# EasyEDA Pro project Instruction_Register.eprj

# Schematic Schematic2
Board Name: Board2; Create Date: 2025-08-15; Page Name: P1; Project Name: Instruction_Register; Schematic Name: Schematic2; Update Date: 2025-08-15; Company: EasyEDA.com; Page Size: A4; Version: V1.0
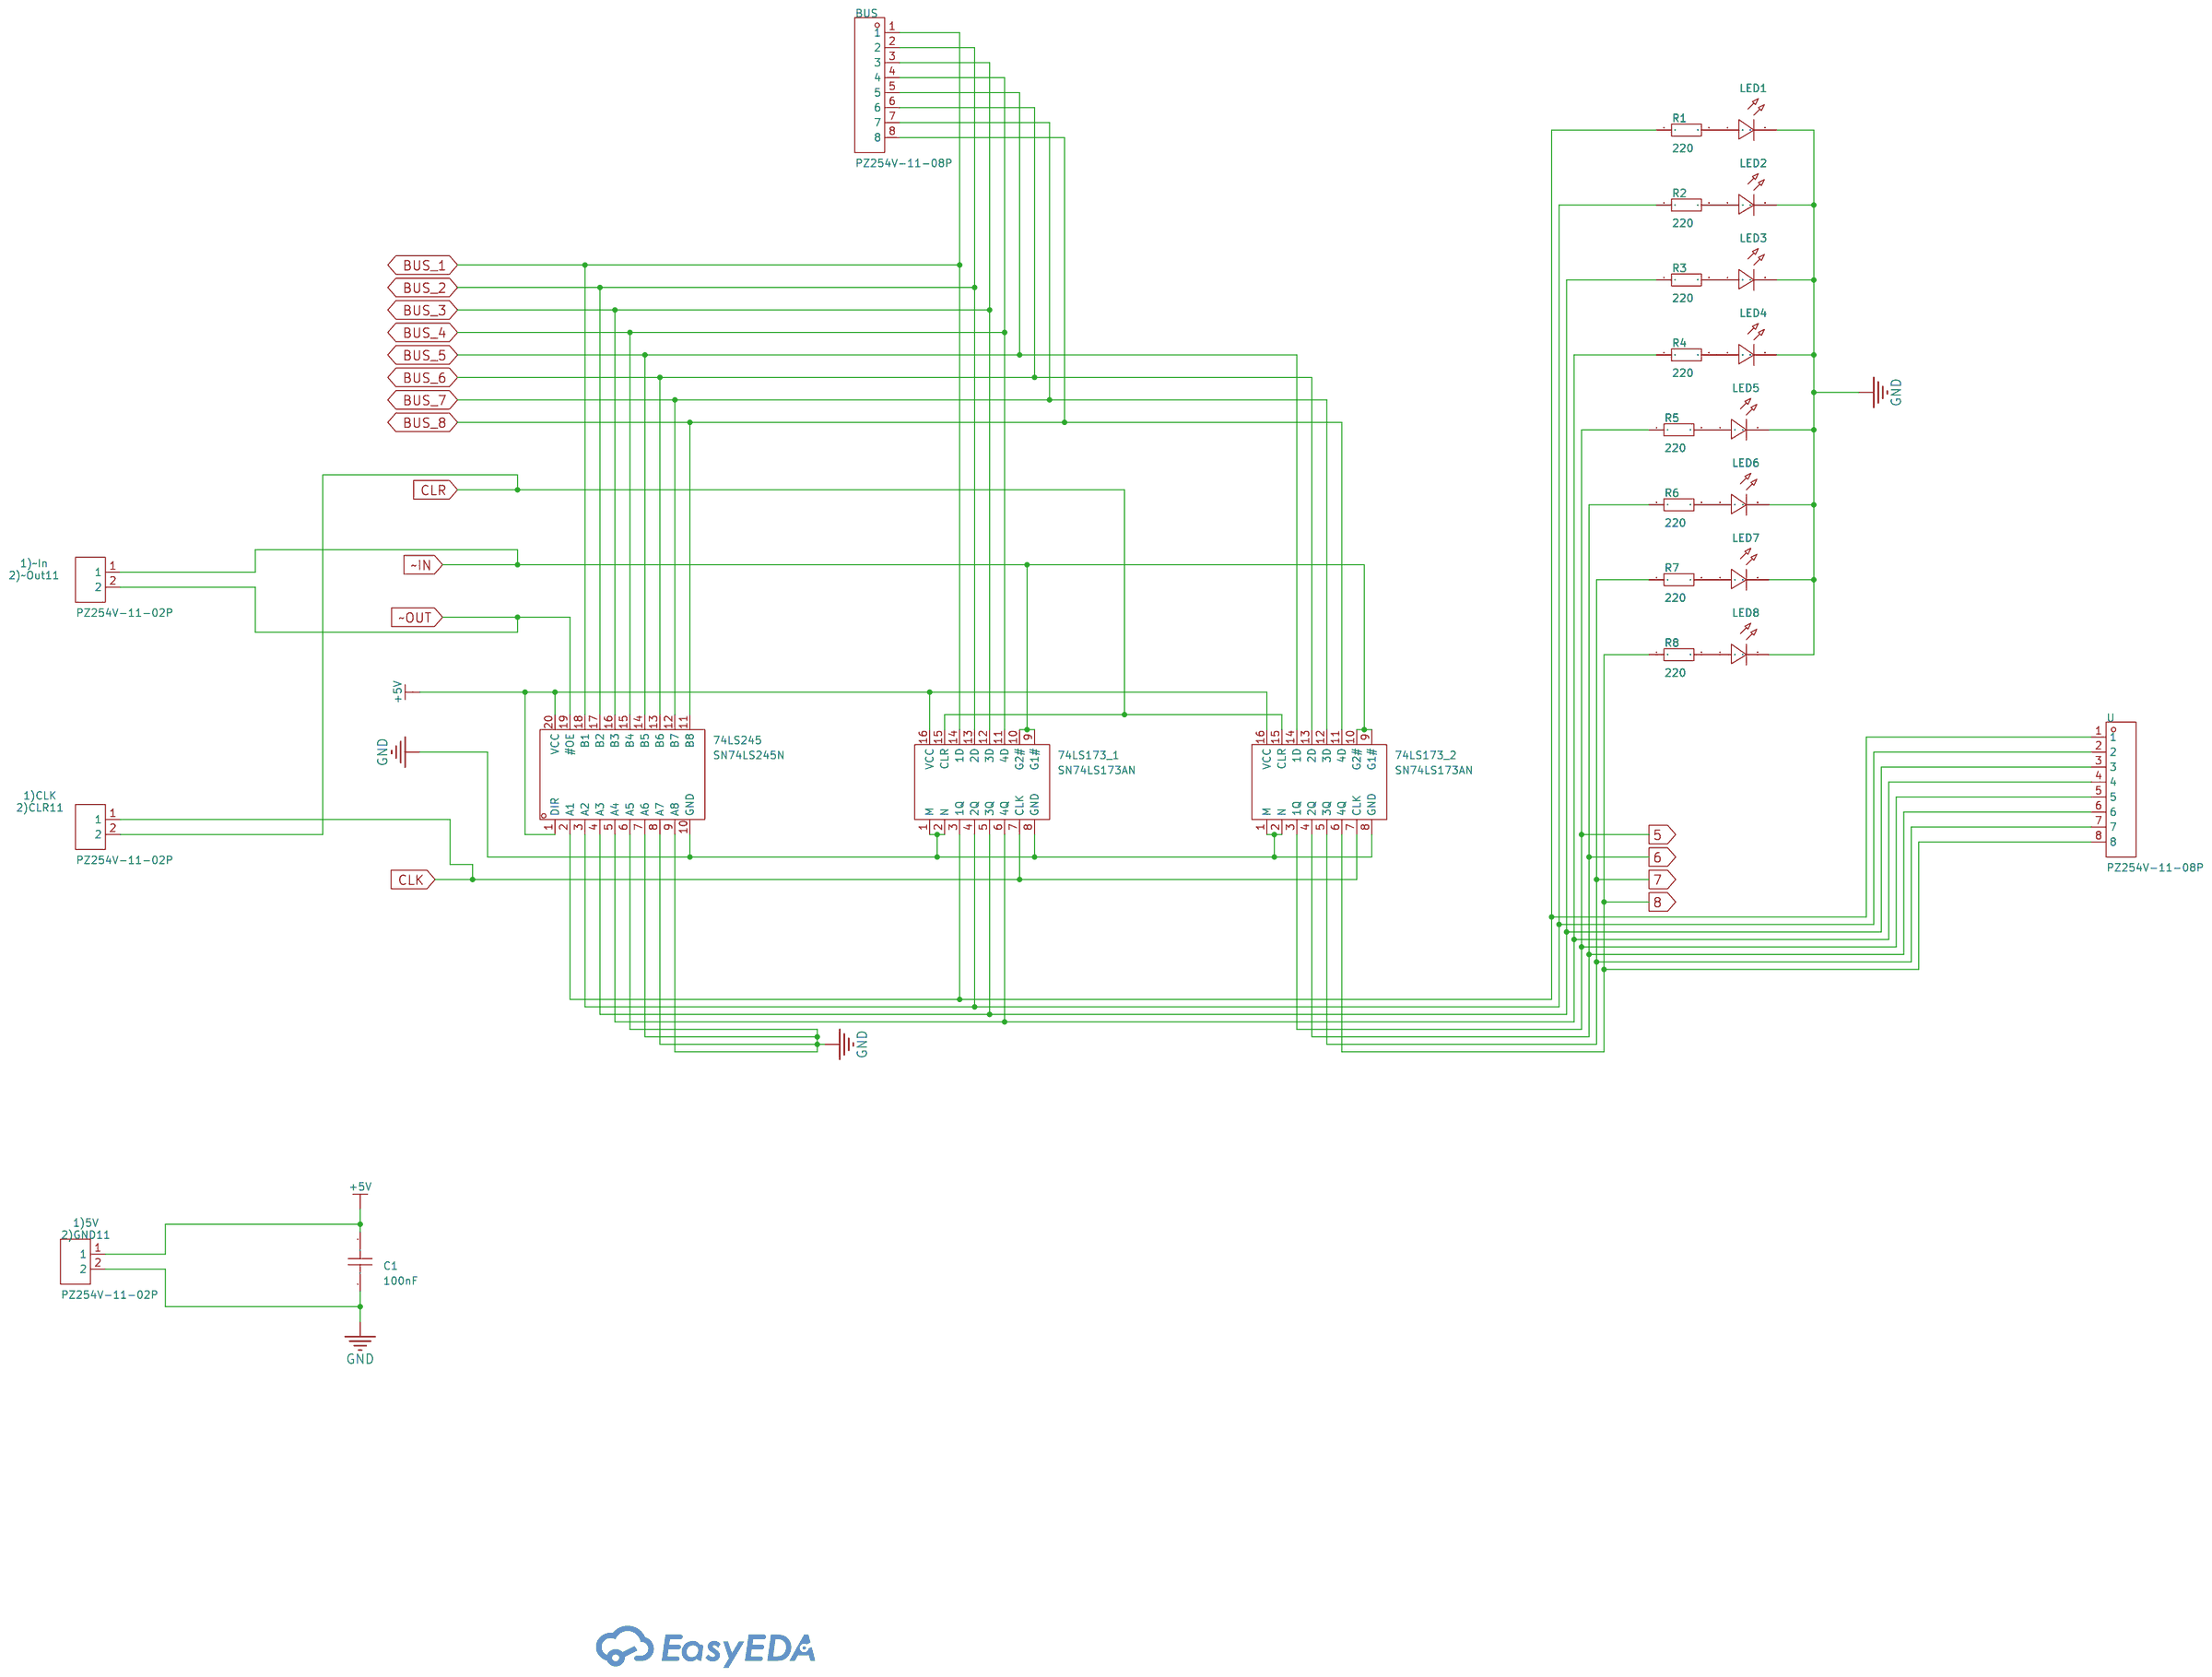
[diagram p0: schematic sheet]

## Parts
1)5V
2)GND11  PZ254V-11-02P  [HDR-TH_2P-P2.54-V-M]
1)CLK
2)CLR11  PZ254V-11-02P  [HDR-TH_2P-P2.54-V-M]
1)~In
2)~Out11  PZ254V-11-02P  [HDR-TH_2P-P2.54-V-M]
74LS173_1  SN74LS173AN  [PDIP-16_L19.3-W6.4-P2.54-LS7.94-BL]
74LS173_2  SN74LS173AN  [PDIP-16_L19.3-W6.4-P2.54-LS7.94-BL]
74LS245  SN74LS245N  [DIP-20_L25.5-W10.0-P2.54-LS7.6-BL]
BUS  PZ254V-11-08P  [HDR-TH_8P-P2.54-V-M]
C1  100nF  [CAP-TH_L8.5-W5.0-P5.00-D1.2]
LED1  -  [LED-TH_BD5.8-P2.54-FD]
LED2  -  [LED-TH_BD5.8-P2.54-FD]
LED3  -  [LED-TH_BD5.8-P2.54-FD]
LED4  -  [LED-TH_BD5.8-P2.54-FD]
LED5  -  [LED-TH_BD5.8-P2.54-FD]
LED6  -  [LED-TH_BD5.8-P2.54-FD]
LED7  -  [LED-TH_BD5.8-P2.54-FD]
LED8  -  [LED-TH_BD5.8-P2.54-FD]
R1  220  [R_AXIAL-0.4]
R2  220  [R_AXIAL-0.4]
R3  220  [R_AXIAL-0.4]
R4  220  [R_AXIAL-0.4]
R5  220  [R_AXIAL-0.4]
R6  220  [R_AXIAL-0.4]
R7  220  [R_AXIAL-0.4]
R8  220  [R_AXIAL-0.4]
U  PZ254V-11-08P  [HDR-TH_8P-P2.54-V-M]

## Library data of the parts
1)5V
2)GND11 1)CLK
2)CLR11 1)~In
2)~Out11 = PZ254V-11-02P: Pin Structure:1x2P Pitch:2.54mm Row Spacing:- Circluar Pins/Square Pins:Policy Mounting Type:Straight Number of Rows:Single Row Number of Pins:2P Current Rating:- Voltage Rating (Max):- Length of Mating Pin:6mm Insulation Height:2.5mm Length of End Connec; LCSC Part Name: 1x2P 间距:2.54mm 方针 直插; Supplier Part: C492401; Manufacturer: XFCN(兴飞); Supplier Footprint: 插件,P=2.54mm; JLCPCB Part Class: Extended Part; Datasheet: https://atta.szlcsc.com/upload/public/pdf/source/20200309/C492401_A812433581A9B211A7FFA413ADDFF0E5.pdf; Supplier: LCSC; Pin Structure: 1x2P; Pitch: 2.54mm; Circluar Pins/Square Pins: Policy; Mounting Type: Straight; Number of Rows: Single Row; Number of Pins: 2P; Length of Mating Pin: 6mm; Insulation Height: 2.5mm; Length of End Connection Pin: 3mm; Contact Material: Brass; Operating Temperature: -40℃~+105℃; Color: Black
74LS173_1 74LS173_2 = SN74LS173AN: Type:D-Type Trigger Type:Rising Edge Voltage - Supply:4.75V~5.25V Voltage - Supply:4.75V~5.25V Clock Frequency:50MHz Function:Reset Number of Elements:1 Number of Bits per Element:4 Output Type:- Propagation Delay:30ns@5V,45pF Series:74LS Series Current -; Supplier Part: C1550125; Manufacturer: TI(德州仪器); Supplier Footprint: PDIP-16; JLCPCB Part Class: Extended Part; Datasheet: https://www.ti.com/cn/lit/gpn/sn74ls173a; Supplier: LCSC; Type: D-Type; Trigger Type: Rising Edge; Voltage - Supply: 4.75V~5.25V; Clock Frequency: 50MHz; Function: Reset; Number of Elements: 1; Number of Bits per Element: 4; Propagation Delay: 30ns@5V,45pF; Series: 74LS Series; Current - Output Low(IOL): 24mA; Current - Output High(IOH): 2.6mA; Quiescent Current: 24mA; Operating Temperature: 0℃~+70℃
74LS245 = SN74LS245N: output type:Tri-State Voltage - Supply:4.75V~5.25V Voltage - Supply:4.75V~5.25V Number of Elements:1 Number of Bits per Element:8 Current - Output Low(IOL):24mA Current - Output High(IOH):15mA Logic Family:74LS Operating Temperature:0℃~+70℃ Operating Temp; Supplier Part: C352966; Manufacturer: TI(德州仪器); Supplier Footprint: DIP-20; JLCPCB Part Class: Extended Part; Datasheet: https://www.ti.com/cn/lit/gpn/sn74ls245; Supplier: LCSC; output type: Tri-State; Voltage - Supply: 4.75V~5.25V; Number of Elements: 1; Number of Bits per Element: 8; Current - Output Low(IOL): 24mA; Current - Output High(IOH): 15mA; Logic Family: 74LS; Operating Temperature: 0℃~+70℃
BUS U = PZ254V-11-08P: Pin Structure:1x8P Pitch:2.54mm Row Spacing:- Circluar Pins/Square Pins:Square Pins Mounting Type:Straight Number of Rows:Plugin Number of Pins:8P Current Rating (Max):- Voltage Rating (Max):- Length of Mating Pin:6mm Insulation Height:2.5mm Length of End; LCSC Part Name: 间距:2.54mm 1x8P 直插 方针; Supplier Part: C492407; Manufacturer: XFCN(兴飞); Supplier Footprint: 插件,P=2.54mm; JLCPCB Part Class: Extended Part; Datasheet: https://atta.szlcsc.com/upload/public/pdf/source/20200309/C492407_83A6FB26A2233368EDB9516968EC6149.pdf; Supplier: LCSC; Pin Structure: 1x8P; Pitch: 2.54mm; Circluar Pins/Square Pins: Square Pins; Mounting Type: Straight; Number of Rows: Plugin; Number of Pins: 8P; Length of Mating Pin: 6mm; Insulation Height: 2.5mm; Length of End Connection Pin: 3mm; Operating Temperature Range: -40℃~+105℃; Color: Black
C1 = CT4-0805B104K500F3: Capacitance:100nF Tolerance:±10% Tolerance:±10% Voltage Rated: Temperature Coefficient:; LCSC Part Name: 100nF ±10% 50V C3型（直脚）; Supplier Part: C84772; Manufacturer: FH(风华); Supplier Footprint: 插件,P=5.08mm; JLCPCB Part Class: Extended Part; Datasheet: https://atta.szlcsc.com/upload/public/pdf/source/20190402/C385200_059806A6312B28FF1421A2413EB641E1.pdf; Supplier: LCSC; Tolerance: ±10%
LED1-LED8 = LED_TH-R_5mm: Supplier Footprint: Through
R1-R8 = Res_AXIAL-1/4W: Supplier Footprint: Through

## Nets
+5V: 1)5V
2)GND11.1 74LS173_1.16(VCC) 74LS173_2.16(VCC) 74LS245.1(DIR) 74LS245.20(VCC) C1.1
GND: 1)5V
2)GND11.2 74LS173_1.1(M) 74LS173_1.2(N) 74LS173_1.8(GND) 74LS173_2.1(M) 74LS173_2.2(N) 74LS173_2.8(GND) 74LS245.6(A5) 74LS245.7(A6) 74LS245.8(A7) 74LS245.9(A8) 74LS245.10(GND) C1.2 LED1.2(A) LED2.2(A) LED3.2(A) LED4.2(A) LED5.2(A) LED6.2(A) LED7.2(A) LED8.2(A)
5: 74LS173_2.3(1Q) R5.1 U.5
6: 74LS173_2.4(2Q) R6.1 U.6
7: 74LS173_2.5(3Q) R7.1 U.7
8: 74LS173_2.6(4Q) R8.1 U.8
BUS_1: 74LS173_1.14(1D) 74LS245.18(B1) BUS.1
BUS_2: 74LS173_1.13(2D) 74LS245.17(B2) BUS.2
BUS_3: 74LS173_1.12(3D) 74LS245.16(B3) BUS.3
BUS_4: 74LS173_1.11(4D) 74LS245.15(B4) BUS.4
BUS_5: 74LS173_2.14(1D) 74LS245.14(B5) BUS.5
BUS_6: 74LS173_2.13(2D) 74LS245.13(B6) BUS.6
BUS_7: 74LS173_2.12(3D) 74LS245.12(B7) BUS.7
BUS_8: 74LS173_2.11(4D) 74LS245.11(B8) BUS.8
CLK: 1)CLK
2)CLR11.1 74LS173_1.7(CLK) 74LS173_2.7(CLK)
CLR: 1)CLK
2)CLR11.2 74LS173_1.15(CLR) 74LS173_2.15(CLR)
~IN: 1)~In
2)~Out11.1 74LS173_1.9(G1#) 74LS173_1.10(G2#) 74LS173_2.9(G1#) 74LS173_2.10(G2#)
~OUT: 1)~In
2)~Out11.2 74LS245.19(#OE)
$1N2512: LED1.1(C) R1.2
$1N2517: 74LS173_1.6(4Q) 74LS245.5(A4) R4.1 U.4
$1N2518: 74LS173_1.5(3Q) 74LS245.4(A3) R3.1 U.3
$1N2519: 74LS173_1.4(2Q) 74LS245.3(A2) R2.1 U.2
$1N2520: 74LS173_1.3(1Q) 74LS245.2(A1) R1.1 U.1
$1N2521: LED8.1(C) R8.2
$1N2522: LED7.1(C) R7.2
$1N2523: LED6.1(C) R6.2
$1N2524: LED5.1(C) R5.2
$1N2525: LED4.1(C) R4.2
$1N2526: LED3.1(C) R3.2
$1N2527: LED2.1(C) R2.2

# Board PCB2
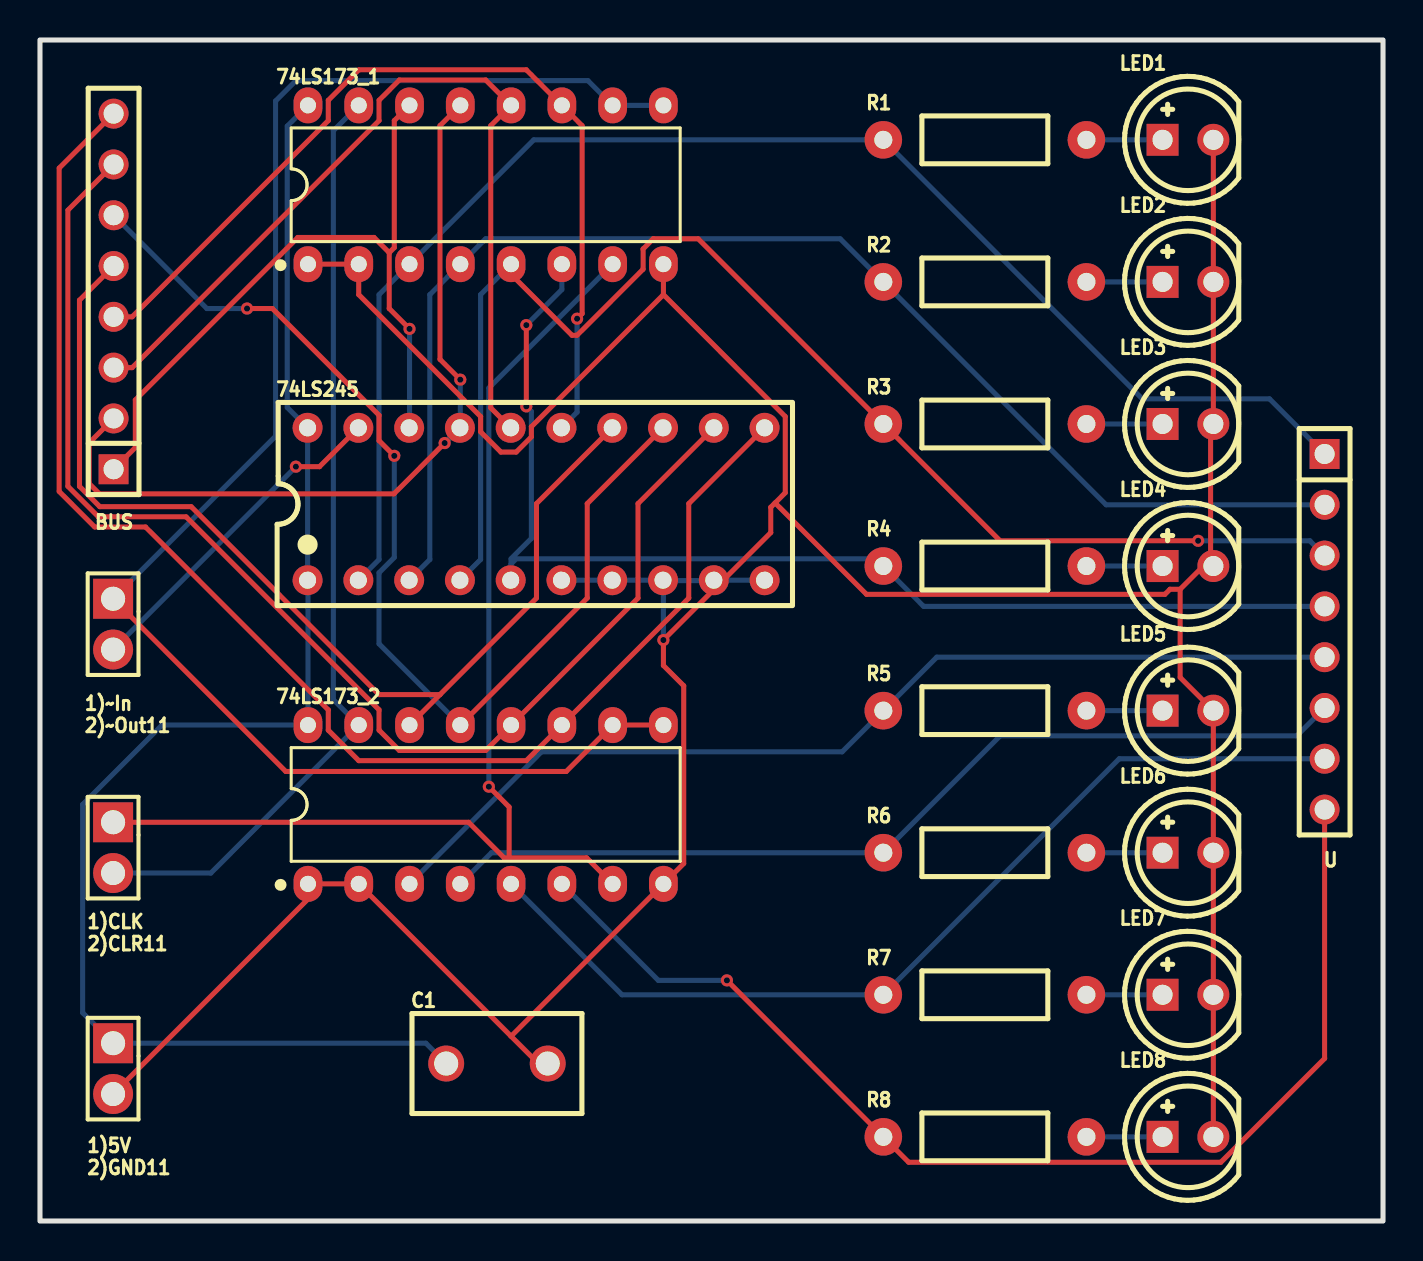
[diagram p1: board, top side]
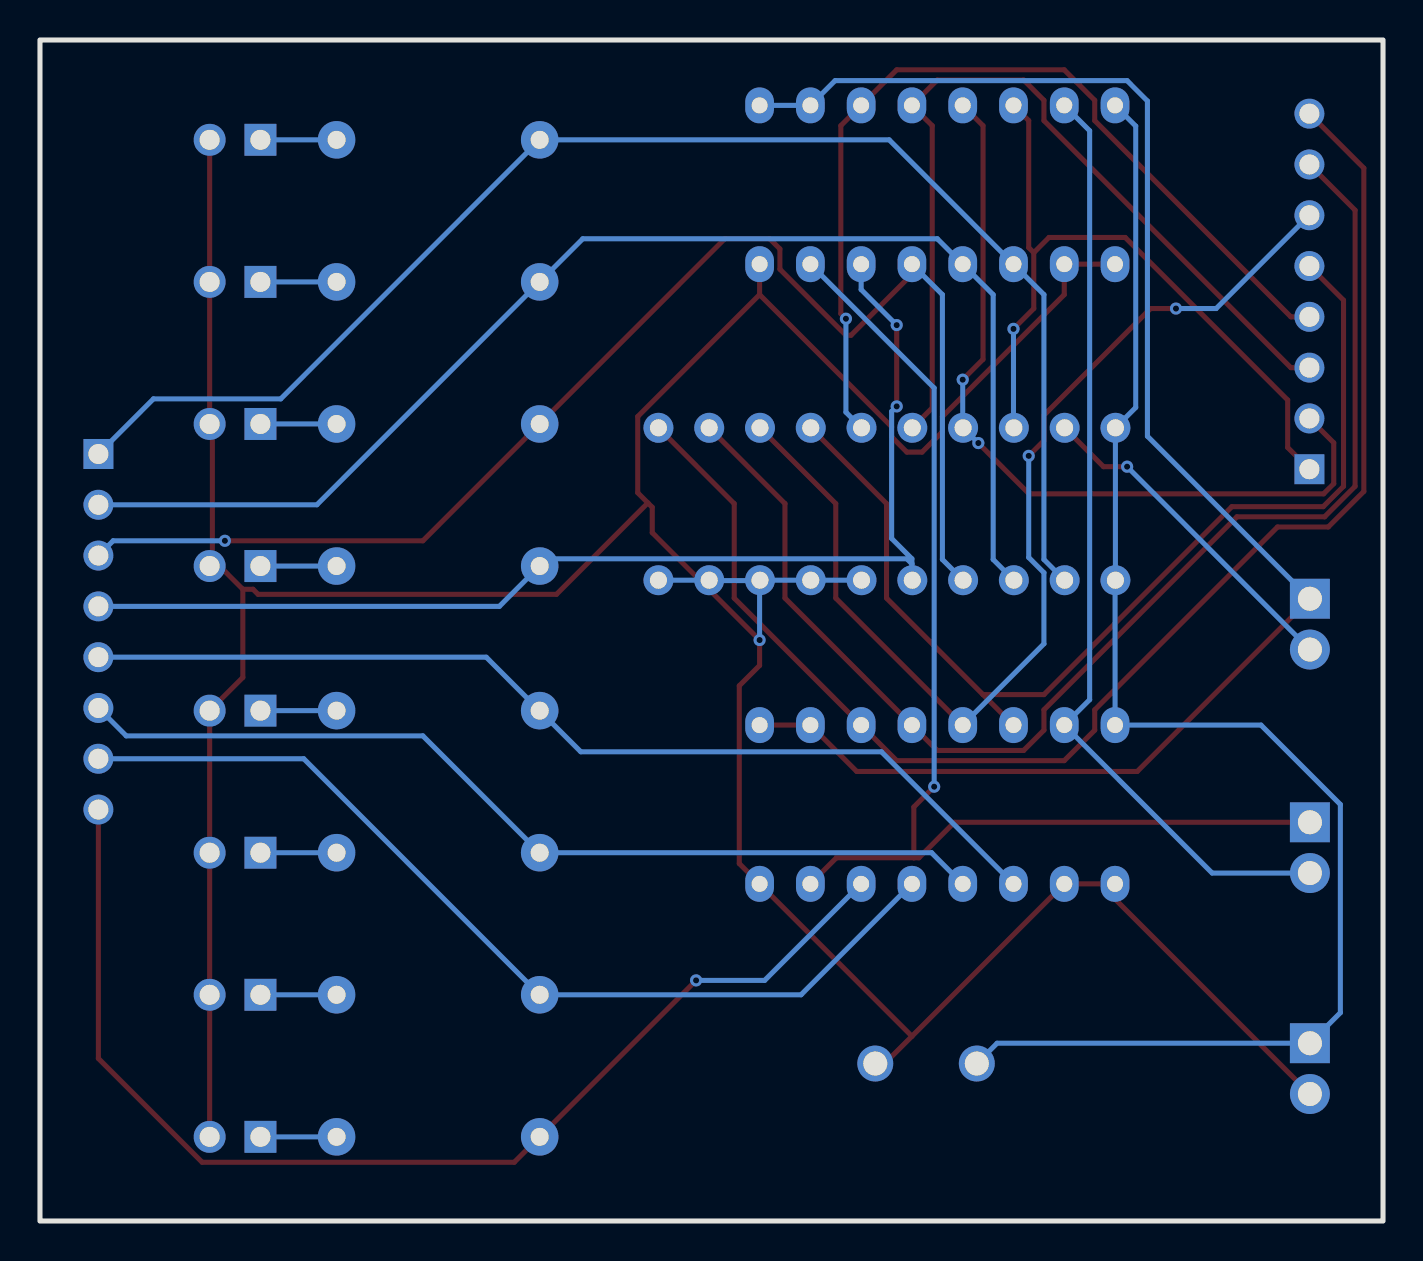
[diagram p2: board, bottom side, seen from below]

Outline 67.18 x 59.05 mm; copper layers: Top Layer, Bottom Layer. Coordinates in mm from the lower left corner of the outline.
Outline path: rectangle 0,59.05 67.18,0
Stack: Top Layer 0.035mm / Dielectric1 1.51mm FR4 er 4.5 / Bottom Layer 0.035mm

## Design rules (mm)
template: JLCPCB Capability(Two Layers Board)
spacing copperThickness1oz (default): track to track 0.102, other pairs 0.152 to 0.3
spacing copperThickness2oz: track to track 0.203, other pairs 0.152 to 0.3
track width copperThickness1oz (default): min 0.127, default 0.254, max 2.54
track width copperThickness2oz: min 0.203, default 0.254, max 2.54
differential pair differentialPair (default): width min 0.127, default 0.254, max 2.54; gap min 0.152, default 0.152
via viaSize (default): diameter min 0.5, default 0.61, max 10; hole min 0.3, default 0.305, max 6.3

## Placement (name value [footprint] x y rotation side)
1)5V
2)GND11  PZ254V-11-02P  [HDR-TH_2P-P2.54-V-M]  3.66 7.62 270 top
1)CLK
2)CLR11  PZ254V-11-02P  [HDR-TH_2P-P2.54-V-M]  3.66 18.67 270 top
1)~In
2)~Out11  PZ254V-11-02P  [HDR-TH_2P-P2.54-V-M]  3.66 29.84 270 top
74LS173_1  SN74LS173AN  [PDIP-16_L19.3-W6.4-P2.54-LS7.94-BL]  22.3 51.82 0 top
74LS173_2  SN74LS173AN  [PDIP-16_L19.3-W6.4-P2.54-LS7.94-BL]  22.3 20.83 0 top
74LS245  SN74LS245N  [DIP-20_L25.5-W10.0-P2.54-LS7.6-BL]  24.82 35.85 0 top
BUS  PZ254V-11-08P  [HDR-TH_8P-P2.54-V-M]  3.68 46.48 90 top
C1  100nF  [CAP-TH_L8.5-W5.0-P5.00-D1.2]  22.86 7.87 0 top
LED1  -  [LED-TH_BD5.8-P2.54-FD]  57.43 54.06 0 top
LED2  -  [LED-TH_BD5.8-P2.54-FD]  57.43 46.96 0 top
LED3  -  [LED-TH_BD5.8-P2.54-FD]  57.43 39.85 0 top
LED4  -  [LED-TH_BD5.8-P2.54-FD]  57.43 32.75 0 top
LED5  -  [LED-TH_BD5.8-P2.54-FD]  57.43 25.52 0 top
LED6  -  [LED-TH_BD5.8-P2.54-FD]  57.43 18.42 0 top
LED7  -  [LED-TH_BD5.8-P2.54-FD]  57.43 11.31 0 top
LED8  -  [LED-TH_BD5.8-P2.54-FD]  57.43 4.21 0 top
R1  220  [R_AXIAL-0.4]  47.27 54.06 0 top
R2  220  [R_AXIAL-0.4]  47.27 46.96 0 top
R3  220  [R_AXIAL-0.4]  47.27 39.85 0 top
R4  220  [R_AXIAL-0.4]  47.27 32.75 0 top
R5  220  [R_AXIAL-0.4]  47.27 25.52 0 top
R6  220  [R_AXIAL-0.4]  47.27 18.42 0 top
R7  220  [R_AXIAL-0.4]  47.27 11.31 0 top
R8  220  [R_AXIAL-0.4]  47.27 4.21 0 top
U  PZ254V-11-08P  [HDR-TH_8P-P2.54-V-M]  64.26 29.46 270 top

## Footprints (pads in the part's own frame, mm; a bottom-side part is the same pattern mirrored in y, then rotated)
CAP-TH_L8.5-W5.0-P5.00-D1.2
  round 1.8 hole 1.2: 1(-2.54,0) 2(2.54,0)
DIP-20_L25.5-W10.0-P2.54-LS7.6-BL
  round 1.5 hole 0.85: 1(-11.43,-3.81) 2(-8.89,-3.81) 3(-6.35,-3.81) 4(-3.81,-3.81) 5(-1.27,-3.81) 6(1.27,-3.81) 7(3.81,-3.81) 8(6.35,-3.81) 9(8.89,-3.81) 10(11.43,-3.81) 11(11.43,3.81) 12(8.89,3.81) 13(6.35,3.81) 14(3.81,3.81) 15(1.27,3.81) 16(-1.27,3.81) 17(-3.81,3.81) 18(-6.35,3.81) 19(-8.89,3.81) 20(-11.43,3.81)
HDR-TH_2P-P2.54-V-M
  rect 2x2 hole 1.2: 1(-1.27,0)
  round 2 hole 1.2: 2(1.27,0)
HDR-TH_8P-P2.54-V-M
  rect 1.5x1.5 hole 1: 1(-8.89,0)
  round 1.5 hole 1: 2(-6.35,0) 3(-3.81,0) 4(-1.27,0) 5(1.27,0) 6(3.81,0) 7(6.35,0) 8(8.89,0)
LED-TH_BD5.8-P2.54-FD
  rect 1.6x1.6 hole 1: 1(-1.27,0)
  round 1.6 hole 1: 2(1.27,0)
PDIP-16_L19.3-W6.4-P2.54-LS7.94-BL
  oval 1.44x1.8 hole 0.8: 1(-8.89,-3.97) 2(-6.35,-3.97) 3(-3.81,-3.97) 4(-1.27,-3.97) 5(1.27,-3.97) 6(3.81,-3.97) 7(6.35,-3.97) 8(8.89,-3.97) 9(8.89,3.97) 10(6.35,3.97) 11(3.81,3.97) 12(1.27,3.97) 13(-1.27,3.97) 14(-3.81,3.97) 15(-6.35,3.97) 16(-8.89,3.97)
R_AXIAL-0.4
  round 1.879 hole 0.899: 1(-5.08,0) 2(5.08,0)

## Nets
As in the schematic.

## Via types
v1: diameter 0.61, hole 0.305, Top Layer to Bottom Layer, 13 vias

## Routing (per net, layer and track width the routed paths; a pad name or vN(x,y) marks a point on that pad's centre or on a via; arc(x,y) is an arc through that point)
+5V: length 74.4
  Bottom Layer w0.254: C1.1 19.3,8.89 1)5V
2)GND11.1 2.13,10.41 2.13,20.83 6.1,24.8 74LS173_2.16 13.41,32.02 74LS245.1 74LS245.20 12.37,40.68 12.37,54.75 74LS173_1.16
GND: length 191.5
  Top Layer w0.254: 23.57,9.24 74LS173_2.2 74LS173_2.1 13.41,16.1 1)5V
2)GND11.2 ; 23.57,9.24 74LS173_2.8 32.2,17.87 32.2,26.76 31.19,27.78 v1(31.19,29.05) 36.56,34.42 36.56,35.69 36.77,35.91 ; 23.57,9.24 24.93,7.87 C1.2 ; 58.56,33.11 58.56,32.89 LED4.2 ; 58.56,33.11 58.56,39.72 LED3.2 LED2.2 LED1.2 ; 58.56,33.11 57.03,31.59 ; 74LS173_1.1 74LS173_1.2 15.95,46.32 22.04,40.23 22.04,39.46 23.06,38.45 23.82,38.45 24.58,39.21 24.58,39.72 31.19,46.32 ; 57.03,31.59 57.03,27.18 LED5.2 LED6.2 LED7.2 LED8.2 ; 57.03,31.59 56.53,31.59 56.27,31.34 41.35,31.34 36.77,35.91 ; 31.19,46.32 37.28,40.23 37.28,36.42 36.77,35.91 ; 31.19,46.32 74LS173_1.8
  Bottom Layer w0.254: 31.19,32.02 33.69,32.02 74LS245.9 74LS245.10 ; 31.19,32.02 74LS245.8 74LS245.7 74LS245.6 ; 31.19,32.02 v1(31.19,29.05)
5: length 50.5
  Bottom Layer w0.254: 74LS173_2.3 25.09,23.46 40.13,23.46 R5.1 44.86,28.19 U.5
6: length 46.9
  Bottom Layer w0.254: U.6 62.87,24.26 48.03,24.26 R6.1 22.58,18.42 74LS173_2.4
7: length 47.9
  Bottom Layer w0.254: 74LS173_2.5 29.11,11.31 R7.1 53.99,23.11 U.7
8: length 58.5
  Top Layer w0.254: U.8 64.26,8.13 59.07,2.94 43.46,2.94 R8.1 v1(34.36,12.03)
  Bottom Layer w0.254: 74LS173_2.6 30.93,12.03 v1(34.36,12.03)
BUS_1: length 37.3
  Top Layer w0.254: v1(18.49,44.61) 17.47,45.63 17.47,48.42 ; 17.47,48.42 17.72,48.67 17.72,55.02 74LS173_1.14 ; 17.47,48.42 16.71,49.18 12.9,49.18 4.77,41.05 4.77,38.68 BUS.1
  Bottom Layer w0.254: v1(18.49,44.61) 18.49,39.68 74LS245.18
BUS_2: length 40.9
  Top Layer w0.254: BUS.2 2.46,38.91 2.46,36.87 2.97,36.36 17.7,36.36 v1(20.24,38.9) ; 74LS173_1.13 20.01,54.77 20.01,43.09 v1(21.03,42.07)
  Bottom Layer w0.254: v1(21.03,42.07) 21.03,39.68 74LS245.17 v1(20.24,38.9)
BUS_3: length 43.9
  Top Layer w0.254: BUS.3 4.61,42.67 16.96,55.02 16.96,56.04 17.98,57.06 22.3,57.06 74LS173_1.12 22.55,54.77 22.55,40.66 74LS245.16
BUS_4: length 45.8
  Top Layer w0.254: v1(26.87,45.12) 27.12,45.37 27.12,54.77 74LS173_1.11 24.33,57.56 15.95,57.56 14.42,56.04 14.42,55.02 4.61,45.21 BUS.4
  Bottom Layer w0.254: v1(26.87,45.12) 26.87,40.44 74LS245.15
BUS_5: length 53.1
  Top Layer w0.254: 74LS245.14 24.84,35.87 24.84,31.15 20.01,26.32 ; 20.01,26.32 16.96,26.32 7.56,35.72 2.99,35.72 1.98,36.74 1.98,46.04 BUS.5 ; 20.01,26.32 74LS173_2.14
BUS_6: length 54.3
  Top Layer w0.254: v1(17.72,38.26) 16.96,39.02 16.96,40.29 11.63,45.63 v1(10.36,45.63) ; 74LS173_2.13 27.38,31.15 27.38,35.87 74LS245.13
  Bottom Layer w0.254: v1(17.72,38.26) 17.72,33.18 16.96,32.42 16.96,28.86 74LS173_2.13 ; v1(10.36,45.63) 8.35,45.63 BUS.6
BUS_7: length 64.9
  Top Layer w0.254: 74LS245.12 29.92,35.87 29.92,31.15 74LS173_2.12 22.3,23.53 17.98,23.53 16.96,24.54 16.96,25.56 7.31,35.21 2.92,35.21 1.4,36.74 1.4,50.55 BUS.7
BUS_8: length 71.1
  Top Layer w0.254: 74LS245.11 32.46,35.87 32.46,31.15 74LS173_2.11 24.33,23.02 15.95,23.02 14.42,24.54 14.42,25.56 5.28,34.7 2.74,34.7 0.96,36.48 0.96,52.65 BUS.8
CLK: length 58.9
  Top Layer w0.254: 23.47,18.16 27.34,18.16 74LS173_2.7 ; 23.47,18.16 23.22,18.16 21.44,19.94 1)CLK
2)CLR11.1 ; 23.47,18.16 23.47,20.7 v1(22.45,21.72)
  Bottom Layer w0.254: v1(22.45,21.72) 22.45,41.65 74LS173_1.7
CLR: length 47.4
  Bottom Layer w0.254: 1)CLK
2)CLR11.2 8.55,17.4 74LS173_2.15 14.68,26.07 14.68,54.52 74LS173_1.15
~IN: length 80.7
  Top Layer w0.254: 74LS173_2.9 74LS173_2.10 26.33,22.48 12.29,22.48 1)~In
2)~Out11.1
  Bottom Layer w0.254: 74LS173_1.9 74LS173_1.10 27.41,57.02 12.8,57.02 11.79,56.01 11.79,39.24 1)~In
2)~Out11.1
~OUT: length 16.9
  Top Layer w0.254: 74LS245.19 13.98,37.72 v1(12.8,37.72)
  Bottom Layer w0.254: 1)~In
2)~Out11.2 v1(12.8,37.72)
$1N2512: length 3.8
  Bottom Layer w0.254: LED1.1 R1.2
$1N2517: length 58.9
  Top Layer w0.254: v1(24.33,44.8) v1(24.33,40.73)
  Bottom Layer w0.254: 74LS173_1.6 26.11,46.58 v1(24.33,44.8) ; U.4 44.2,30.73 R4.1 41.82,33.11 23.82,33.11 23.57,32.86 ; 23.57,32.86 23.57,33.11 24.58,34.13 24.58,40.48 v1(24.33,40.73) ; 23.57,32.86 23.57,32.06 74LS245.5
$1N2518: length 68.5
  Top Layer w0.254: 74LS173_1.5 23.57,47.34 26.61,44.29 26.87,44.29 30.17,47.59 30.17,48.61 30.68,49.12 32.93,49.12 R3.1 48.03,34.01 v1(57.93,34.01)
  Bottom Layer w0.254: U.3 63.52,34.01 v1(57.93,34.01) ; 74LS245.4 22.04,33.08 22.04,46.32 74LS173_1.5
$1N2519: length 66.1
  Bottom Layer w0.254: 74LS245.3 19.5,33.08 19.5,46.32 74LS173_1.4 22.3,49.12 40.03,49.12 R2.1 53.33,35.81 U.2
$1N2520: length 71.7
  Bottom Layer w0.254: U.1 61.51,41.11 55.14,41.11 R1.1 24.7,54.06 74LS173_1.3 16.96,46.32 16.96,33.08 74LS245.2
$1N2521: length 3.8
  Bottom Layer w0.254: LED8.1 R8.2
$1N2522: length 3.8
  Bottom Layer w0.254: LED7.1 R7.2
$1N2523: length 3.8
  Bottom Layer w0.254: LED6.1 R6.2
$1N2524: length 3.8
  Bottom Layer w0.254: LED5.1 R5.2
$1N2525: length 3.8
  Bottom Layer w0.254: LED4.1 R4.2
$1N2526: length 3.8
  Bottom Layer w0.254: LED3.1 R3.2
$1N2527: length 3.8
  Bottom Layer w0.254: LED2.1 R2.2
